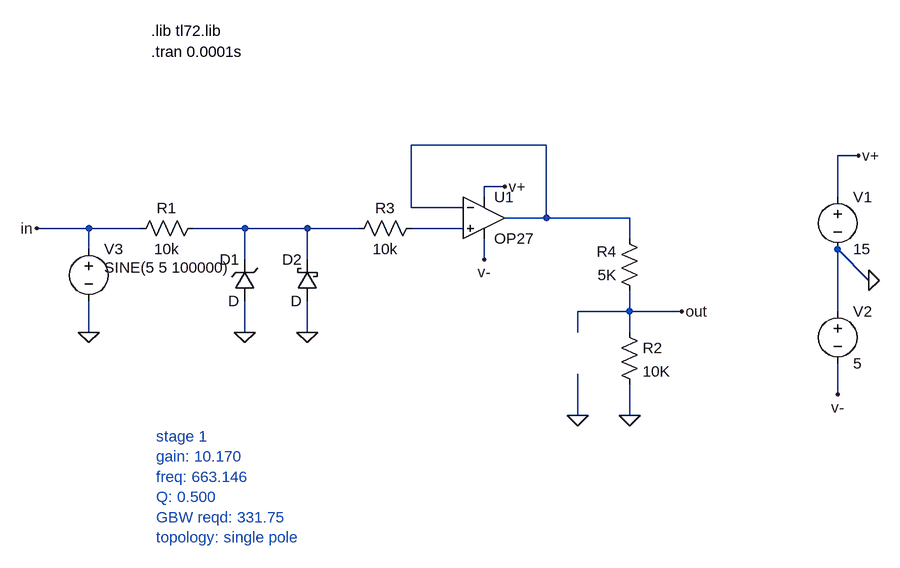
[diagram p0: schematic buffy_test.asc]
buffy_test.asc, the LTspice schematic file:
Version 4
SHEET 1 1380 680
WIRE 288 -32 80 -32
WIRE 768 -16 736 -16
WIRE 224 32 192 32
WIRE 192 48 192 32
WIRE 736 48 736 -16
WIRE 80 64 80 -32
WIRE 160 64 80 64
WIRE 288 80 288 -32
WIRE 288 80 224 80
WIRE 416 80 288 80
WIRE -416 96 -496 96
WIRE -336 96 -416 96
WIRE -176 96 -256 96
WIRE -80 96 -176 96
WIRE 0 96 -80 96
WIRE 160 96 80 96
WIRE 416 112 416 80
WIRE -416 128 -416 96
WIRE -176 144 -176 96
WIRE -80 144 -80 96
WIRE 192 144 192 112
WIRE 784 176 736 128
WIRE 416 224 416 192
WIRE 416 224 336 224
WIRE 496 224 416 224
WIRE 736 224 736 128
WIRE -416 256 -416 208
WIRE -176 256 -176 208
WIRE -80 256 -80 208
WIRE 336 256 336 224
WIRE 416 256 416 224
WIRE 736 352 736 304
WIRE 336 384 336 320
WIRE 416 384 416 336
FLAG -176 256 0
FLAG 784 176 0
FLAG 768 -16 v+
FLAG 192 144 v-
FLAG 224 32 v+
FLAG -496 96 in
FLAG -416 256 0
FLAG 416 384 0
FLAG 336 384 0
FLAG -80 256 0
FLAG 496 224 out
FLAG 736 352 v-
SYMBOL res -240 80 R90
WINDOW 0 0 56 VBottom 2
WINDOW 3 32 56 VTop 2
SYMATTR InstName R1
SYMATTR Value 10k
SYMBOL voltage 736 32 R0
WINDOW 123 0 0 Left 0
WINDOW 39 0 0 Left 0
SYMATTR InstName V1
SYMATTR Value 15
SYMBOL voltage -416 112 R0
WINDOW 123 24 44 Left 2
WINDOW 39 0 0 Left 0
WINDOW 3 24 44 Left 2
SYMATTR Value SINE(5 5 100000)
SYMATTR InstName V3
SYMBOL res 432 208 R180
WINDOW 0 36 76 Left 2
WINDOW 3 36 40 Left 2
SYMATTR InstName R4
SYMATTR Value 5K
SYMBOL OpAmps\\OP27 192 16 R0
SYMATTR InstName U1
SYMBOL res 400 240 R0
SYMATTR InstName R2
SYMATTR Value 10K
SYMBOL zener -160 208 R180
WINDOW 0 24 64 Left 2
WINDOW 3 24 0 Left 2
SYMATTR InstName D1
SYMBOL schottky -64 208 R180
WINDOW 0 24 64 Left 2
WINDOW 3 24 0 Left 2
SYMATTR InstName D2
SYMBOL res 96 80 R90
WINDOW 0 0 56 VBottom 2
WINDOW 3 32 56 VTop 2
SYMATTR InstName R3
SYMATTR Value 10k
SYMBOL voltage 736 208 R0
WINDOW 123 0 0 Left 0
WINDOW 39 0 0 Left 0
SYMATTR InstName V2
SYMATTR Value 5
TEXT -320 -208 Left 2 !.lib tl72.lib
TEXT -320 -176 Left 2 !.tran 0.0001s
TEXT -312 416 Left 2 ;stage 1\ngain: 10.170\nfreq: 663.146\nQ: 0.500\nGBW reqd: 331.75\ntopology: single pole

The netlist it stands for:
* buffy_test.asc
R1 N002 in 10k
V1 v+ 0 15
V3 in 0 SINE(5 5 100000)
R4 out N001 5K
XU1 N003 N001 v+ v- N001 OP27  ; pins In+ In- V+ V- OUT
R2 out 0 10K
D1 0 N002 D
D2 0 N002 D
R3 N003 N002 10k
V2 0 v- 5
.model D D
.lib standard.dio
.lib tl72.lib
.tran 0.0001s
* stage 1
* gain: 10.170
* freq: 663.146
* Q: 0.500
* GBW reqd: 331.75
* topology: single pole
.lib ADI.lib
.backanno
.end